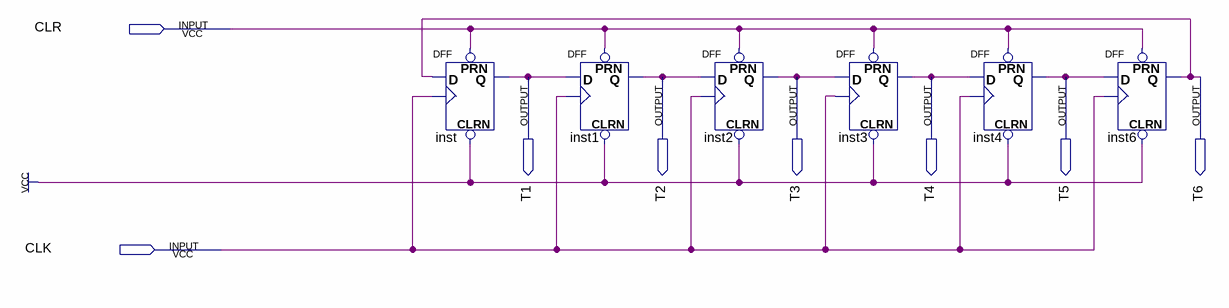
[diagram p0: schematic sheet]
// Quartus schematic Ring_Counter.bdf as structural Verilog: 6 symbols, 8 pins
module Ring_Counter (
  input  CLR,
  input  CLK,
  output T1,
  output T2,
  output T3,
  output T4,
  output T5,
  output T6
);

  DFF inst (.CLRN(1'b1), .CLK(CLK), .D(T6), .PRN(CLR), .Q(T1));
  DFF inst1 (.CLRN(1'b1), .CLK(CLK), .D(T1), .PRN(CLR), .Q(T2));
  DFF inst2 (.CLRN(1'b1), .CLK(CLK), .D(T2), .PRN(CLR), .Q(T3));
  DFF inst3 (.CLRN(1'b1), .CLK(CLK), .D(T3), .PRN(CLR), .Q(T4));
  DFF inst4 (.CLRN(1'b1), .CLK(CLK), .D(T4), .PRN(CLR), .Q(T5));
  DFF inst6 (.CLRN(1'b1), .CLK(CLK), .D(T5), .PRN(CLR), .Q(T6));
endmodule
